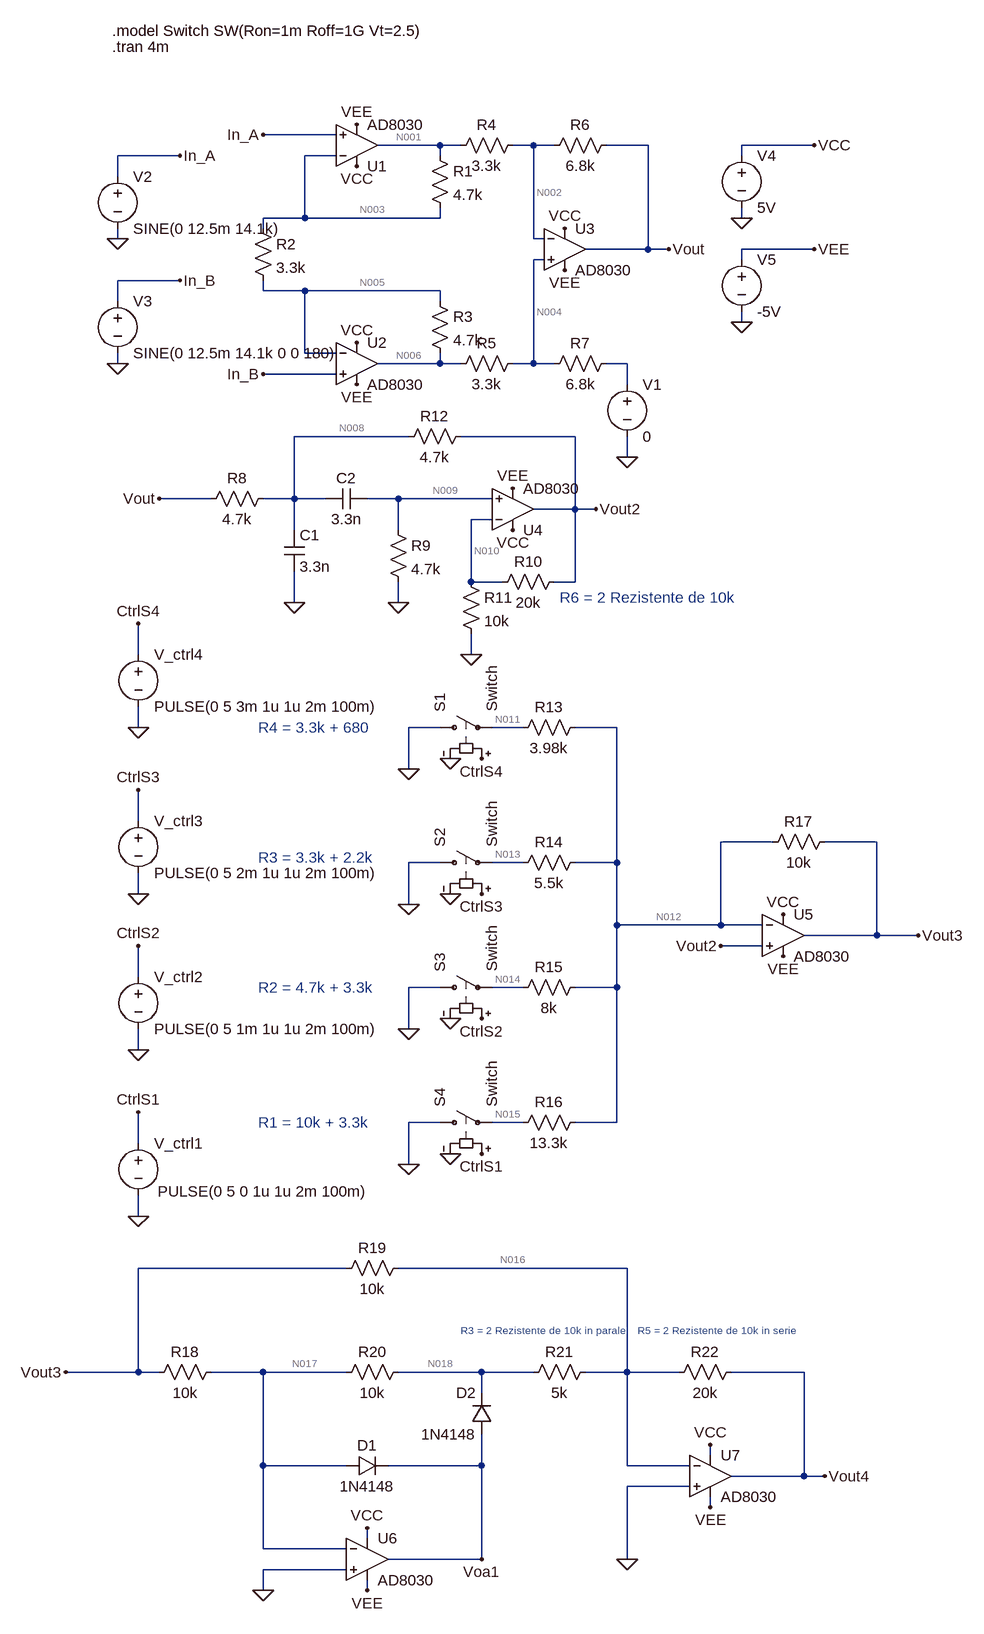
[diagram p0: schematic Circuit Total.asc]
Circuit Total.asc, the LTspice schematic file:
Version 4.1
SHEET 1 1028 2744
WIRE -32 416 -144 416
WIRE 128 432 32 432
WIRE 160 432 128 432
WIRE 272 432 240 432
WIRE 304 432 272 432
WIRE 448 432 384 432
WIRE 704 432 592 432
WIRE -272 448 -368 448
WIRE -32 448 -80 448
WIRE 128 448 128 432
WIRE 592 448 592 432
WIRE -368 480 -368 448
WIRE -80 544 -80 448
WIRE -80 544 -144 544
WIRE 128 544 128 528
WIRE 128 544 -80 544
WIRE 592 544 592 528
WIRE -144 560 -144 544
WIRE -368 576 -368 560
WIRE 272 576 272 432
WIRE 288 576 272 576
WIRE 448 592 448 432
WIRE 448 592 352 592
WIRE 480 592 448 592
WIRE 704 592 592 592
WIRE 288 608 272 608
WIRE 592 608 592 592
WIRE -272 640 -368 640
WIRE -144 656 -144 640
WIRE -80 656 -144 656
WIRE 128 656 -80 656
WIRE -368 672 -368 640
WIRE 128 672 128 656
WIRE 592 704 592 688
WIRE -80 752 -80 656
WIRE -32 752 -80 752
WIRE -368 768 -368 752
WIRE 128 768 128 752
WIRE 128 768 32 768
WIRE 160 768 128 768
WIRE 272 768 272 608
WIRE 272 768 240 768
WIRE 304 768 272 768
WIRE 416 768 384 768
WIRE -32 784 -144 784
WIRE 416 800 416 768
WIRE 80 880 -96 880
WIRE 336 880 160 880
WIRE 416 912 416 880
WIRE -224 976 -304 976
WIRE -96 976 -96 880
WIRE -96 976 -144 976
WIRE -48 976 -96 976
WIRE 64 976 16 976
WIRE 208 976 64 976
WIRE 336 992 336 880
WIRE 336 992 272 992
WIRE 368 992 336 992
WIRE 208 1008 176 1008
WIRE -96 1024 -96 976
WIRE 64 1024 64 976
WIRE 176 1104 176 1008
WIRE 224 1104 176 1104
WIRE 336 1104 336 992
WIRE 336 1104 304 1104
WIRE -96 1136 -96 1088
WIRE 64 1136 64 1104
WIRE -336 1216 -336 1168
WIRE 176 1216 176 1184
WIRE -336 1328 -336 1296
WIRE 128 1328 80 1328
WIRE 256 1328 208 1328
WIRE 400 1328 336 1328
WIRE 80 1392 80 1328
WIRE -336 1472 -336 1424
WIRE 640 1504 560 1504
WIRE 800 1504 720 1504
WIRE 128 1536 80 1536
WIRE 256 1536 208 1536
WIRE 400 1536 400 1328
WIRE 400 1536 336 1536
WIRE -336 1584 -336 1552
WIRE 80 1600 80 1536
WIRE 400 1632 400 1536
WIRE 560 1632 560 1504
WIRE 560 1632 400 1632
WIRE 624 1632 560 1632
WIRE 800 1648 800 1504
WIRE 800 1648 688 1648
WIRE 864 1648 800 1648
WIRE 624 1664 560 1664
WIRE -336 1712 -336 1664
WIRE 128 1728 80 1728
WIRE 256 1728 208 1728
WIRE 400 1728 400 1632
WIRE 400 1728 336 1728
WIRE 80 1792 80 1728
WIRE -336 1824 -336 1792
WIRE 128 1936 80 1936
WIRE 256 1936 208 1936
WIRE 400 1936 400 1728
WIRE 400 1936 336 1936
WIRE -336 1968 -336 1920
WIRE 80 2000 80 1936
WIRE -336 2080 -336 2048
WIRE -16 2160 -336 2160
WIRE 416 2160 64 2160
WIRE -336 2320 -336 2160
WIRE -336 2320 -448 2320
WIRE -304 2320 -336 2320
WIRE -144 2320 -224 2320
WIRE -16 2320 -144 2320
WIRE 192 2320 64 2320
WIRE 272 2320 192 2320
WIRE 416 2320 416 2160
WIRE 416 2320 352 2320
WIRE 496 2320 416 2320
WIRE 688 2320 576 2320
WIRE 192 2352 192 2320
WIRE 544 2448 544 2432
WIRE -144 2464 -144 2320
WIRE -16 2464 -144 2464
WIRE 192 2464 192 2416
WIRE 192 2464 48 2464
WIRE 416 2464 416 2320
WIRE 512 2464 416 2464
WIRE 688 2480 688 2320
WIRE 688 2480 576 2480
WIRE 720 2480 688 2480
WIRE 512 2496 416 2496
WIRE 544 2528 544 2512
WIRE 16 2576 16 2560
WIRE -144 2592 -144 2464
WIRE -16 2592 -144 2592
WIRE 192 2608 192 2464
WIRE 192 2608 48 2608
WIRE 416 2608 416 2496
WIRE -16 2624 -144 2624
WIRE -144 2656 -144 2624
WIRE 16 2656 16 2640
FLAG 416 912 0
FLAG -368 768 0
FLAG -368 576 0
FLAG -272 448 In_A
FLAG -144 416 In_A
FLAG -272 640 In_B
FLAG -144 784 In_B
FLAG 480 592 Vout
FLAG 0 464 VCC
FLAG 320 560 VCC
FLAG 0 736 VCC
FLAG 0 400 VEE
FLAG 320 624 VEE
FLAG 0 800 VEE
FLAG 592 704 0
FLAG 592 544 0
FLAG 704 432 VCC
FLAG 704 592 VEE
FLAG -96 1136 0
FLAG 64 1136 0
FLAG 176 1216 0
FLAG 240 1024 VCC
FLAG 240 960 VEE
FLAG 368 992 Vout2
FLAG -304 976 Vout
FLAG 80 1392 0
FLAG 80 1600 0
FLAG 80 1792 0
FLAG 80 2000 0
FLAG 864 1648 Vout3
FLAG 144 1376 0
FLAG 144 1584 0
FLAG 144 1776 0
FLAG 144 1984 0
FLAG -336 1328 0
FLAG -336 1584 0
FLAG -336 1824 0
FLAG -336 2080 0
FLAG -336 1920 CtrlS1
FLAG 192 1984 CtrlS1
FLAG -336 1664 CtrlS2
FLAG 192 1776 CtrlS2
FLAG -336 1424 CtrlS3
FLAG 192 1584 CtrlS3
FLAG -336 1168 CtrlS4
FLAG 192 1376 CtrlS4
FLAG 656 1616 VCC
FLAG 656 1680 VEE
FLAG 560 1664 Vout2
FLAG -144 2656 0
FLAG 416 2608 0
FLAG 544 2432 VCC
FLAG 16 2560 VCC
FLAG 544 2528 VEE
FLAG 16 2656 VEE
FLAG 720 2480 Vout4
FLAG 192 2608 Voa1
FLAG -448 2320 Vout3
DATAFLAG 448 592 ""
SYMBOL OpAmps\\AD8030 0 496 M180
SYMATTR InstName U1
SYMBOL OpAmps\\AD8030 0 704 R0
SYMATTR InstName U2
SYMBOL OpAmps\\AD8030 320 528 R0
SYMATTR InstName U3
SYMBOL res 112 432 R0
SYMATTR InstName R1
SYMATTR Value 4.7k
SYMBOL res -160 544 R0
SYMATTR InstName R2
SYMATTR Value 3.3k
SYMBOL res 112 656 R0
SYMATTR InstName R3
SYMATTR Value 4.7k
SYMBOL res 256 416 R90
WINDOW 0 0 56 VBottom 2
WINDOW 3 32 56 VTop 2
SYMATTR InstName R4
SYMATTR Value 3.3k
SYMBOL res 256 752 R90
WINDOW 0 0 56 VBottom 2
WINDOW 3 32 56 VTop 2
SYMATTR InstName R5
SYMATTR Value 3.3k
SYMBOL res 400 416 R90
WINDOW 0 0 56 VBottom 2
WINDOW 3 32 56 VTop 2
SYMATTR InstName R6
SYMATTR Value 6.8k
SYMBOL res 400 752 R90
WINDOW 0 0 56 VBottom 2
WINDOW 3 32 56 VTop 2
SYMATTR InstName R7
SYMATTR Value 6.8k
SYMBOL voltage 416 784 R0
WINDOW 123 0 0 Left 0
WINDOW 39 0 0 Left 0
SYMATTR InstName V1
SYMATTR Value 0
SYMBOL voltage -368 464 R0
WINDOW 123 24 124 Left 2
WINDOW 39 0 0 Left 0
SYMATTR InstName V2
SYMATTR Value SINE(0 12.5m 14.1k)
SYMBOL voltage -368 656 R0
WINDOW 123 24 124 Left 2
WINDOW 39 0 0 Left 0
SYMATTR InstName V3
SYMATTR Value SINE(0 12.5m 14.1k 0 0 180)
SYMBOL voltage 592 432 R0
WINDOW 123 24 124 Left 2
WINDOW 39 0 0 Left 0
SYMATTR InstName V4
SYMATTR Value 5V
SYMBOL voltage 592 592 R0
WINDOW 123 0 0 Left 0
WINDOW 39 0 0 Left 0
SYMATTR InstName V5
SYMATTR Value -5V
SYMBOL res -128 960 R90
WINDOW 0 0 56 VBottom 2
WINDOW 3 32 56 VTop 2
SYMATTR InstName R8
SYMATTR Value 4.7k
SYMBOL cap -112 1024 R0
SYMATTR InstName C1
SYMATTR Value 3.3n
SYMBOL cap 16 960 R90
WINDOW 0 0 32 VBottom 2
WINDOW 3 32 32 VTop 2
SYMATTR InstName C2
SYMATTR Value 3.3n
SYMBOL res 48 1008 R0
SYMATTR InstName R9
SYMATTR Value 4.7k
SYMBOL OpAmps\\AD8030 240 1056 M180
SYMATTR InstName U4
SYMBOL res 320 1088 R90
WINDOW 0 0 56 VBottom 2
WINDOW 3 32 56 VTop 2
SYMATTR InstName R10
SYMATTR Value 20k
SYMBOL res 160 1088 R0
SYMATTR InstName R11
SYMATTR Value 10k
SYMBOL res 176 864 R90
WINDOW 0 0 56 VBottom 2
WINDOW 3 32 56 VTop 2
SYMATTR InstName R12
SYMATTR Value 4.7k
SYMBOL sw 112 1328 R270
SYMATTR InstName S1
SYMATTR Value Switch
SYMBOL sw 112 1536 R270
SYMATTR InstName S2
SYMATTR Value Switch
SYMBOL sw 112 1728 R270
SYMATTR InstName S3
SYMATTR Value Switch
SYMBOL sw 112 1936 R270
SYMATTR InstName S4
SYMATTR Value Switch
SYMBOL res 352 1312 R90
WINDOW 0 0 56 VBottom 2
WINDOW 3 32 56 VTop 2
SYMATTR InstName R13
SYMATTR Value 3.98k
SYMBOL res 352 1520 R90
WINDOW 0 0 56 VBottom 2
WINDOW 3 32 56 VTop 2
SYMATTR InstName R14
SYMATTR Value 5.5k
SYMBOL res 352 1712 R90
WINDOW 0 0 56 VBottom 2
WINDOW 3 32 56 VTop 2
SYMATTR InstName R15
SYMATTR Value 8k
SYMBOL res 352 1920 R90
WINDOW 0 0 56 VBottom 2
WINDOW 3 32 56 VTop 2
SYMATTR InstName R16
SYMATTR Value 13.3k
SYMBOL OpAmps\\AD8030 656 1584 R0
SYMATTR InstName U5
SYMBOL res 736 1488 R90
WINDOW 0 0 56 VBottom 2
WINDOW 3 32 56 VTop 2
SYMATTR InstName R17
SYMATTR Value 10k
SYMBOL voltage -336 1952 R0
WINDOW 3 30 90 Left 2
WINDOW 123 0 0 Left 0
WINDOW 39 0 0 Left 0
SYMATTR Value PULSE(0 5 0 1u 1u 2m 100m)
SYMATTR InstName V_ctrl1
SYMBOL voltage -336 1696 R0
WINDOW 123 0 0 Left 0
WINDOW 39 0 0 Left 0
SYMATTR InstName V_ctrl2
SYMATTR Value PULSE(0 5 1m 1u 1u 2m 100m)
SYMBOL voltage -336 1456 R0
WINDOW 123 0 0 Left 0
WINDOW 39 0 0 Left 0
SYMATTR InstName V_ctrl3
SYMATTR Value PULSE(0 5 2m 1u 1u 2m 100m)
SYMBOL voltage -336 1200 R0
WINDOW 123 0 0 Left 0
WINDOW 39 0 0 Left 0
SYMATTR InstName V_ctrl4
SYMATTR Value PULSE(0 5 3m 1u 1u 2m 100m)
SYMBOL res -208 2304 R90
WINDOW 0 0 56 VBottom 2
WINDOW 3 32 56 VTop 2
SYMATTR InstName R18
SYMATTR Value 10k
SYMBOL res 80 2144 R90
WINDOW 0 0 56 VBottom 2
WINDOW 3 32 56 VTop 2
SYMATTR InstName R19
SYMATTR Value 10k
SYMBOL res 80 2304 R90
WINDOW 0 0 56 VBottom 2
WINDOW 3 32 56 VTop 2
SYMATTR InstName R20
SYMATTR Value 10k
SYMBOL diode -16 2480 R270
WINDOW 0 32 32 VTop 2
WINDOW 3 0 32 VBottom 2
SYMATTR InstName D1
SYMATTR Value 1N4148
SYMBOL diode 208 2416 R180
WINDOW 0 24 64 Left 2
WINDOW 3 24 0 Left 2
SYMATTR InstName D2
SYMATTR Value 1N4148
SYMBOL res 368 2304 R90
WINDOW 0 0 56 VBottom 2
WINDOW 3 32 56 VTop 2
SYMATTR InstName R21
SYMATTR Value 5k
SYMBOL OpAmps\\AD8030 16 2544 R0
SYMATTR InstName U6
SYMBOL res 592 2304 R90
WINDOW 0 0 56 VBottom 2
WINDOW 3 32 56 VTop 2
SYMATTR InstName R22
SYMATTR Value 20k
SYMBOL OpAmps\\AD8030 544 2416 R0
SYMATTR InstName U7
TEXT -376 280 Left 2 !.tran 4m
TEXT 312 1128 Left 2 ;R6 = 2 Rezistente de 10k
TEXT -376 256 Left 2 !.model Switch SW(Ron=1m Roff=1G Vt=2.5)
TEXT -152 1936 Left 2 ;R1 = 10k + 3.3k
TEXT -152 1728 Left 2 ;R2 = 4.7k + 3.3k
TEXT -152 1528 Left 2 ;R3 = 3.3k + 2.2k
TEXT -152 1328 Left 2 ;R4 = 3.3k + 680
TEXT 432 2256 Left 1 ;R5 = 2 Rezistente de 10k in serie
TEXT 160 2256 Left 1 ;R3 = 2 Rezistente de 10k in paralel

The netlist it stands for:
* Circuit Total.asc
X§U1 In_A N003 VCC VEE N001 AD8040  ; AD8030, pins In+ In- V+ V- OUT
X§U2 In_B N005 VCC VEE N006 AD8040  ; AD8030, pins In+ In- V+ V- OUT
X§U3 N004 N002 VCC VEE Vout AD8040  ; AD8030, pins In+ In- V+ V- OUT
R1 N001 N003 4.7k
R2 N003 N005 3.3k
R3 N005 N006 4.7k
R4 N002 N001 3.3k
R5 N004 N006 3.3k
R6 Vout N002 6.8k
R7 N007 N004 6.8k
V1 N007 0 0
V2 In_A 0 SINE(0 12.5m 14.1k)
V3 In_B 0 SINE(0 12.5m 14.1k 0 0 180)
V4 VCC 0 5V
V5 VEE 0 -5V
R8 N008 Vout 4.7k
C1 N008 0 3.3n
C2 N009 N008 3.3n
R9 N009 0 4.7k
X§U4 N009 N010 VCC VEE Vout2 AD8040  ; AD8030, pins In+ In- V+ V- OUT
R10 Vout2 N010 20k
R11 N010 0 10k
R12 Vout2 N008 4.7k
S1 0 N011 CtrlS4 0 Switch
S2 0 N013 CtrlS3 0 Switch
S3 0 N014 CtrlS2 0 Switch
S4 0 N015 CtrlS1 0 Switch
R13 N012 N011 3.98k
R14 N012 N013 5.5k
R15 N012 N014 8k
R16 N012 N015 13.3k
X§U5 Vout2 N012 VCC VEE Vout3 AD8040  ; AD8030, pins In+ In- V+ V- OUT
R17 Vout3 N012 10k
V_ctrl1 CtrlS1 0 PULSE(0 5 0 1u 1u 2m 100m)
V_ctrl2 CtrlS2 0 PULSE(0 5 1m 1u 1u 2m 100m)
V_ctrl3 CtrlS3 0 PULSE(0 5 2m 1u 1u 2m 100m)
V_ctrl4 CtrlS4 0 PULSE(0 5 3m 1u 1u 2m 100m)
R18 N017 Vout3 10k
R19 N016 Vout3 10k
R20 N018 N017 10k
D1 N017 Voa1 1N4148
D2 Voa1 N018 1N4148
R21 N016 N018 5k
X§U6 0 N017 VCC VEE Voa1 AD8040  ; AD8030, pins In+ In- V+ V- OUT
R22 Vout4 N016 20k
X§U7 0 N016 VCC VEE Vout4 AD8040  ; AD8030, pins In+ In- V+ V- OUT
.model D D
.lib standard.dio
.tran 4m
* R6 = 2 Rezistente de 10k
.model Switch SW(Ron=1m Roff=1G Vt=2.5)
* R1 = 10k + 3.3k
* R2 = 4.7k + 3.3k
* R3 = 3.3k + 2.2k
* R4 = 3.3k + 680
* R5 = 2 Rezistente de 10k in serie
* R3 = 2 Rezistente de 10k in paralel
.lib ADI.lib
.backanno
.end

* Results of the author's LTspice run, read from the files saved beside the schematic
* Operating Point, zero values left out:
*   V(n001) = -7.989 mV
*   V(n002) = -1.602 mV
*   V(n003) = 743.3 nV
*   V(n004) = -1.601 mV
*   V(n005) = 743.3 nV
*   V(n006) = -7.989 mV
*   V(n008) = -5.01 mV
*   V(n009) = 7.984 mV
*   V(n010) = 7.985 mV
*   V(n011) = -10.02 mV
*   V(n012) = -10.02 mV
*   V(n013) = -10.02 mV
*   V(n014) = -10.02 mV
*   V(n015) = -10.02 mV
*   V(n016) = 273.8 nV
*   V(n017) = -1.879 µV
*   V(n018) = 10.01 mV
*   V(vcc) = 5 V
*   V(vee) = -5 V
*   V(voa1) = 331 mV
*   V(vout) = -781.2 nV
*   V(vout2) = -10.02 mV
*   V(vout3) = -27.04 mV
*   V(vout4) = -19.95 mV
*   I(D1) = -2.519 nA
*   I(D2) = 3.002 µA
*   I(R1) = -1.7 µA
*   I(R10) = -900.2 nA
*   I(R11) = 798.5 nA
*   I(R12) = -1.066 µA
*   I(R13) = -10.03 pA
*   I(R14) = -10.03 pA
*   I(R15) = -10.03 pA
*   I(R16) = -10.03 pA
*   I(R17) = -1.702 µA
*   I(R18) = 2.703 µA
*   I(R19) = 2.704 µA
*   I(R20) = 1.001 µA
*   I(R21) = -2.001 µA
*   I(R22) = -997.7 nA
*   I(R3) = 1.7 µA
*   I(R4) = 1.936 µA
*   I(R5) = 1.936 µA
*   I(R6) = 235.4 nA
*   I(R7) = 235.5 nA
*   I(R8) = -1.066 µA
*   I(R9) = 1.699 µA
*   I(S1) = -10.03 pA
*   I(S2) = -10.03 pA
*   I(S3) = -10.03 pA
*   I(S4) = -10.03 pA
*   I(V1) = -235.5 nA
*   I(V2) = 1.7 µA
*   I(V3) = 1.7 µA
*   I(V4) = -9.138 mA
*   I(V5) = 9.129 mA